# Altium project PCB_Project.PrjPcb
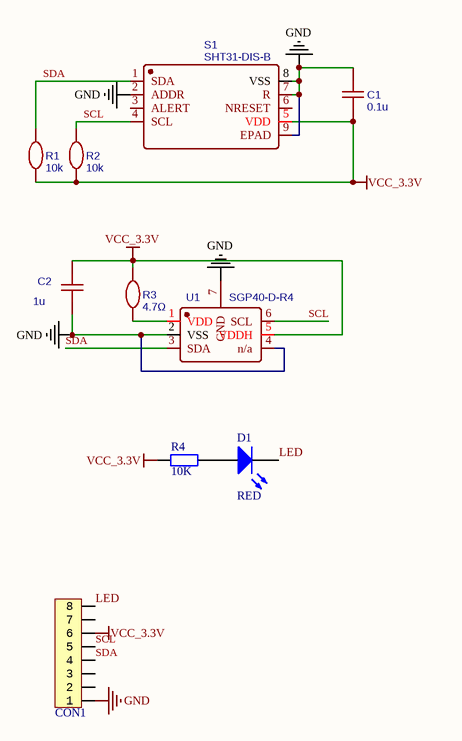
[diagram p0: Sensor_Borad.SchDoc]
1 sheet, 10 parts. Net scope: global (net labels, ports and power ports of the same name join across sheets).
Board file: Sensor_Borad_V0.PcbDoc

## Sheet Sensor_Borad.SchDoc
size A4; SheetNumber: 1; SheetTotal: 1

### Parts
C1  0.1u  [0402_C]
C2  1u  [0402_C]
CON1  FFC_0.5_8  [FFC_0.5_8]  (value not drawn)
D1  RED  [LED_0402_BLUE]
R1  10k  [0402_R]
R2  10k  [0402_R]
R3  4.7Ω  [0402_R]
R4  10K  [0402_R]
S1  SHT31-DIS-B  [DFN8-P0.50]
U1  SGP40-D-R4  [DFN-6_L2.4-W2.4-P0.80-TL-EP]

### Nets
GND: C1.2 C2.1 CON1.1 S1.2(ADDR) S1.7(R) S1.8(VSS) S1.9(EPAD) U1.2(VSS) U1.4(n/a) U1.7(GND)
VCC_3.3V: C1.1 C2.2 CON1.6 R1.1 R2.1 R3.2 R4.1 S1.5(VDD) U1.5(VDDH)
LED: CON1.8 D1.2(K)
SCL: CON1.5 R2.2 S1.4(SCL) U1.6(SCL)
SDA: CON1.4 R1.2 S1.1(SDA) U1.3(SDA)
NetD1_1: D1.1(A) R4.2
NetR3_1: R3.1 U1.1(VDD)

Not connected (* = marked no-connect by the designer): CON1 2 3 7; S1 3(ALERT) 6(NRESET)

### Library data of the parts
C1 = 0.1u: nameAlias: Value(F); Contributor: LCEDA_Lib; spicePre: C; spiceSymbolName: C_0402_US
C2 = 1u: nameAlias: Value(F); Contributor: LCEDA_Lib; spicePre: C; spiceSymbolName: C_0402_US
CON1 = FFC_0.5_8: FFC; System: Connector
D1 = LED0: Typical INFRARED GaAs LED; Published: 8-Jun-2000; LatestRevisionDate: 08-Jul-2005; LatestRevisionNote: Mech Layer 1 removed.; PackageReference: LED-0; Publisher: Altium Limited; Value: RED
R1 R2 = 10k: nameAlias: Value(Ω); Contributor: LCEDA_Lib; spicePre: R; spiceSymbolName: R_0402_EU
R3 = 4.7Ω: nameAlias: Value(Ω); Contributor: LCEDA_Lib; spicePre: R; spiceSymbolName: R_0402_EU
R4 = Res2: Resistor; Published: 8-Jun-2000; LatestRevisionDate: 17-Jul-2002; LatestRevisionNote: Re-released for DXP Platform.; PackageReference: AXIAL-0.4; Publisher: Altium Limited; Value: 10K
S1 = SHT31-DIS-B: BOM_Manufacturer: Sensirion; BOM_Supplier: LCSC; BOM_Manufacturer Part: SHT31-DIS-B; BOM_Supplier Part: C80862; BOM_JLCPCB Part Class: Extended Part; spicePre: S; spiceSymbolName: SHT31-DIS-B
U1 = SGP40-D-R4: BOM_Manufacturer: null; Contributor: LCSC; BOM_Supplier: LCSC; BOM_Supplier Part: C2874215; BOM_Manufacturer Part: SGP40-D-R4; BOM_JLCPCB Part Class: Extended Part; spicePre: U; spiceSymbolName: SGP40-D-R4